# EAGLE design AVR Bus Controller (EAGLE 5.06)
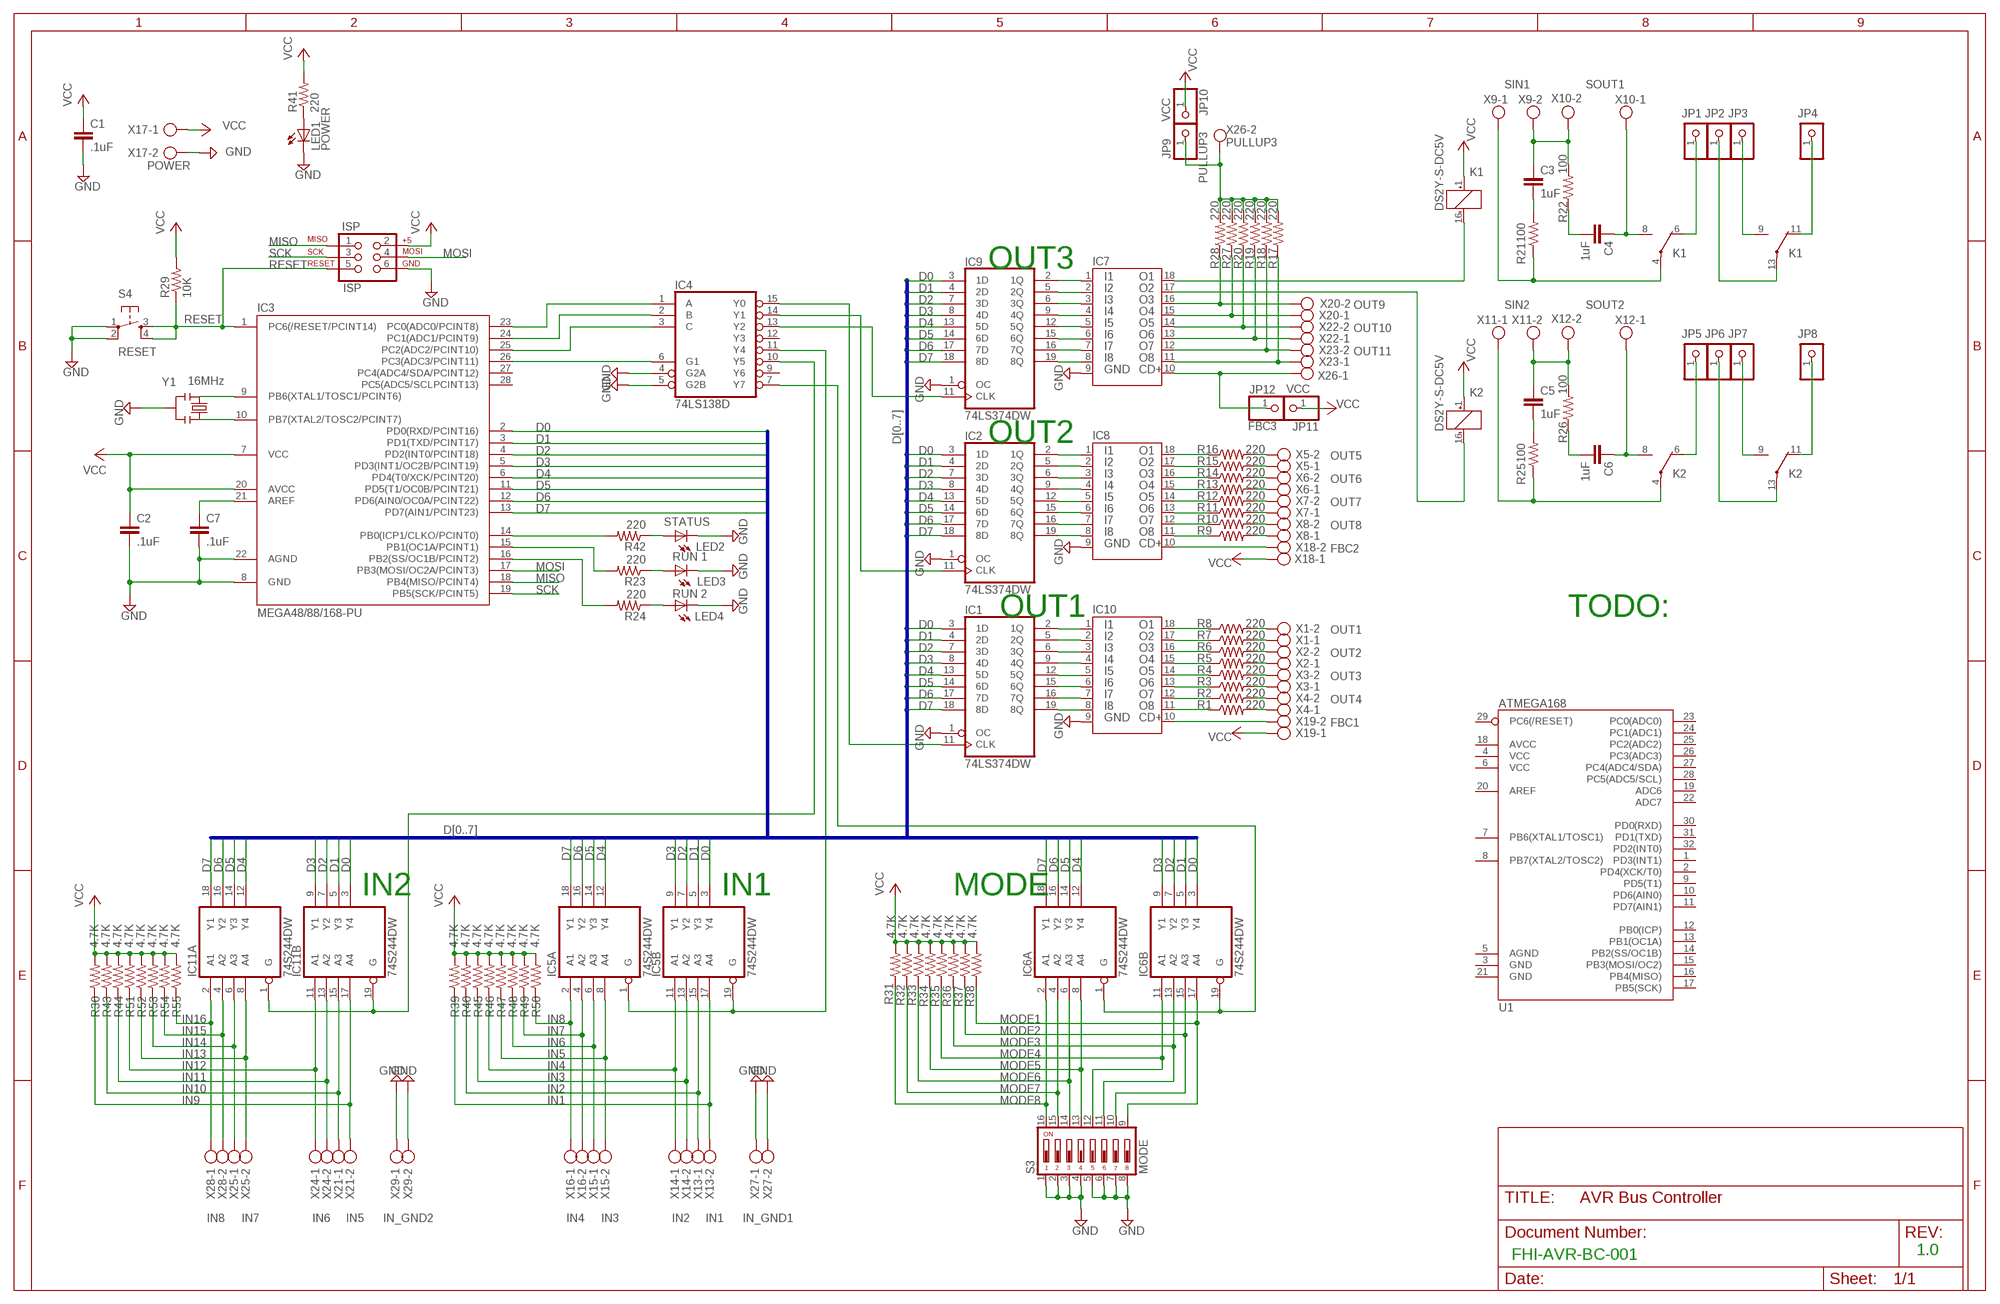
[diagram p0: schematic, sheet 1]

## Parts
C1  .1uF  C-EU025-025X050  [C025-025X050]
C2  .1uF  C-EU025-025X050  [C025-025X050]
C3  1uF  C-EU025-025X050  [C025-025X050]
C4  1uF  C-EU025-025X050  [C025-025X050]
C5  1uF  C-EU025-025X050  [C025-025X050]
C6  1uF  C-EU025-025X050  [C025-025X050]
C7  .1uF  C-EU025-025X050  [C025-025X050]
IC1  74LS374DW  [SO20W]
IC2  74LS374DW  [SO20W]
IC3  MEGA48/88/168-PU  [DIL28-3]
IC4  74LS138D  [SO16]
IC5  74S244DW  [SO20W]
IC6  74S244DW  [SO20W]
IC7  ULN2803SOICW  [SO18L]
IC8  ULN2803SOICW  [SO18L]
IC9  74LS374DW  [SO20W]
IC10  ULN2803SOICW  [SO18L]
IC11  74S244DW  [SO20W]
ISP  ISP  AVR_SPI_PRG_6PTH  [2X3]
JP1  R1_NC1  PINHD-1X1  [1X01]
JP2  R1_NC1  PINHD-1X1  [1X01]
JP3  R1_NC1  PINHD-1X1  [1X01]
JP4  R1_NC1  PINHD-1X1  [1X01]
JP5  R1_NC1  PINHD-1X1  [1X01]
JP6  R1_NC1  PINHD-1X1  [1X01]
JP7  R1_NC1  PINHD-1X1  [1X01]
JP8  R1_NC1  PINHD-1X1  [1X01]
JP9  PULLUP3  PINHD-1X1  [1X01]
JP10  VCC  PINHD-1X1  [1X01]
JP11  VCC  PINHD-1X1  [1X01]
JP12  FBC3  PINHD-1X1  [1X01]
K1  DS2Y-S-DC5V  [DS2Y]
K2  DS2Y-S-DC5V  [DS2Y]
LED1  POWER  LEDCHIPLED_1206  [CHIPLED_1206]
LED2  STATUS  LED5MM  [LED5MM]
LED3  RUN 1  LED5MM  [LED5MM]
LED4  RUN 2  LED5MM  [LED5MM]
R1  220  R-US_0207/2V  [0207/2V]
R2  220  R-US_0207/2V  [0207/2V]
R3  220  R-US_0207/2V  [0207/2V]
R4  220  R-US_0207/2V  [0207/2V]
R5  220  R-US_0207/2V  [0207/2V]
R6  220  R-US_0207/2V  [0207/2V]
R7  220  R-US_0207/2V  [0207/2V]
R8  220  R-US_0207/2V  [0207/2V]
R9  220  R-US_0207/2V  [0207/2V]
R10  220  R-US_0207/2V  [0207/2V]
R11  220  R-US_0207/2V  [0207/2V]
R12  220  R-US_0207/2V  [0207/2V]
R13  220  R-US_0207/2V  [0207/2V]
R14  220  R-US_0207/2V  [0207/2V]
R15  220  R-US_0207/2V  [0207/2V]
R16  220  R-US_0207/2V  [0207/2V]
R17  220  R-US_0207/2V  [0207/2V]
R18  220  R-US_0207/2V  [0207/2V]
R19  220  R-US_0207/2V  [0207/2V]
R20  220  R-US_0207/2V  [0207/2V]
R21  100  R-US_0207/2V  [0207/2V]
R22  100  R-US_0207/2V  [0207/2V]
R23  220  R-US_0207/2V  [0207/2V]
R24  220  R-US_0207/2V  [0207/2V]
R25  100  R-US_0207/2V  [0207/2V]
R26  100  R-US_0207/2V  [0207/2V]
R27  220  R-US_0207/2V  [0207/2V]
R28  220  R-US_0207/2V  [0207/2V]
R29  10K  R-US_0207/2V  [0207/2V]
R30  4.7K  R-US_0207/2V  [0207/2V]
R31  4.7K  R-US_0207/2V  [0207/2V]
R32  4.7K  R-US_0207/2V  [0207/2V]
R33  4.7K  R-US_0207/2V  [0207/2V]
R34  4.7K  R-US_0207/2V  [0207/2V]
R35  4.7K  R-US_0207/2V  [0207/2V]
R36  4.7K  R-US_0207/2V  [0207/2V]
R37  4.7K  R-US_0207/2V  [0207/2V]
R38  4.7K  R-US_0207/2V  [0207/2V]
R39  4.7K  R-US_0207/2V  [0207/2V]
R40  4.7K  R-US_0207/2V  [0207/2V]
R41  220  R-US_0207/2V  [0207/2V]
R42  220  R-US_0207/2V  [0207/2V]
R43  4.7K  R-US_0207/2V  [0207/2V]
R44  4.7K  R-US_0207/2V  [0207/2V]
R45  4.7K  R-US_0207/2V  [0207/2V]
R46  4.7K  R-US_0207/2V  [0207/2V]
R47  4.7K  R-US_0207/2V  [0207/2V]
R48  4.7K  R-US_0207/2V  [0207/2V]
R49  4.7K  R-US_0207/2V  [0207/2V]
R50  4.7K  R-US_0207/2V  [0207/2V]
R51  4.7K  R-US_0207/2V  [0207/2V]
R52  4.7K  R-US_0207/2V  [0207/2V]
R53  4.7K  R-US_0207/2V  [0207/2V]
R54  4.7K  R-US_0207/2V  [0207/2V]
R55  4.7K  R-US_0207/2V  [0207/2V]
S3  MODE  DS08  [DS-08]
S4  RESET  TAC_SWITCHPTH  [TACTILE-PTH]
U1  ATMEGA168  [TQFP32-08]
X1  OUT1  AK550/2  [AK550/2]
X2  OUT2  AK550/2  [AK550/2]
X3  OUT3  AK550/2  [AK550/2]
X4  OUT4  AK550/2  [AK550/2]
X5  OUT5  AK550/2  [AK550/2]
X6  OUT6  AK550/2  [AK550/2]
X7  OUT7  AK550/2  [AK550/2]
X8  OUT8  AK550/2  [AK550/2]
X9  SIN1  AK550/2  [AK550/2]
X10  SOUT1  AK550/2  [AK550/2]
X11  SIN2  AK550/2  [AK550/2]
X12  SOUT2  AK550/2  [AK550/2]
X13  IN1  AK550/2  [AK550/2]
X14  IN2  AK550/2  [AK550/2]
X15  IN3  AK550/2  [AK550/2]
X16  IN4  AK550/2  [AK550/2]
X17  POWER  AK500/2  [AK500/2]
X18  FBC2  AK550/2  [AK550/2]
X19  FBC1  AK550/2  [AK550/2]
X20  OUT9  AK550/2  [AK550/2]
X21  IN5  AK550/2  [AK550/2]
X22  OUT10  AK550/2  [AK550/2]
X23  OUT11  AK550/2  [AK550/2]
X24  IN6  AK550/2  [AK550/2]
X25  IN7  AK550/2  [AK550/2]
X26  PULLUP3  AK550/2  [AK550/2]
X27  IN_GND1  AK550/2  [AK550/2]
X28  IN8  AK550/2  [AK550/2]
X29  IN_GND2  AK550/2  [AK550/2]
Y1  16MHz  RESONATORPTH  [RESONATOR-PTH]

## Nets
A0: IC3.23(PC0(ADC0/PCINT8)) IC4.1(A)
A1: IC3.24(PC1(ADC1/PCINT9)) IC4.2(B)
A2: IC3.25(PC2(ADC2/PCINT10)) IC4.3(C)
D0: IC1.3(1D) IC2.3(1D) IC3.2(PD0(RXD/PCINT16)) IC5.3(B:Y4) IC6.3(B:Y4) IC9.3(1D) IC11.3(B:Y4)
D1: IC1.4(2D) IC2.4(2D) IC3.3(PD1(TXD/PCINT17)) IC5.5(B:Y3) IC6.5(B:Y3) IC9.4(2D) IC11.5(B:Y3)
D2: IC1.7(3D) IC2.7(3D) IC3.4(PD2(INT0/PCINT18)) IC5.7(B:Y2) IC6.7(B:Y2) IC9.7(3D) IC11.7(B:Y2)
D3: IC1.8(4D) IC2.8(4D) IC3.5(PD3(INT1/OC2B/PCINT19)) IC5.9(B:Y1) IC6.9(B:Y1) IC9.8(4D) IC11.9(B:Y1)
D4: IC1.13(5D) IC2.13(5D) IC3.6(PD4(T0/XCK/PCINT20)) IC5.12(A:Y4) IC6.12(A:Y4) IC9.13(5D) IC11.12(A:Y4)
D5: IC1.14(6D) IC2.14(6D) IC3.11(PD5(T1/OC0B/PCINT21)) IC5.14(A:Y3) IC6.14(A:Y3) IC9.14(6D) IC11.14(A:Y3)
D6: IC1.17(7D) IC2.17(7D) IC3.12(PD6(AIN0/OC0A/PCINT22)) IC5.16(A:Y2) IC6.16(A:Y2) IC9.17(7D) IC11.16(A:Y2)
D7: IC1.18(8D) IC2.18(8D) IC3.13(PD7(AIN1/PCINT23)) IC5.18(A:Y1) IC6.18(A:Y1) IC9.18(8D) IC11.18(A:Y1)
EN_A: IC3.26(PC3(ADC3/PCINT11)) IC4.6(G1)
EN_IN1: IC4.11(Y4) IC5.1(A:G) IC5.19(B:G)
EN_MODE: IC4.7(Y7) IC6.1(A:G) IC6.19(B:G)
EN_OUT1: IC1.11(CLK) IC4.15(Y0)
EN_OUT2: IC2.11(CLK) IC4.14(Y1)
EN_OUT3: IC4.13(Y2) IC9.11(CLK)
FBC1: IC10.10 X19.2
FBC2: IC8.10 X18.2
FBC3: IC7.10 JP12.1 X26.1
GND: C1.2 C2.2 C7.2 IC1.1(OC) IC2.1(OC) IC3.8(GND) IC3.22(AGND) IC4.4(G2A) IC4.5(G2B) IC7.9 IC8.9 IC9.1(OC) IC10.9 ISP.6 LED1.C LED2.K(C) LED3.K(C) LED4.K(C) S3.1 S3.2 S3.3 S3.4 S3.5 S3.6 S3.7 S3.8 S4.1 S4.2 X17.2 X27.1 X27.2 X29.1 X29.2 Y1.2
IN1: IC5.17(B:A4) R39.1 X13.2
IN2: IC5.15(B:A3) R40.1 X13.1
IN3: IC5.13(B:A2) R45.1 X14.2
IN4: IC5.11(B:A1) R46.1 X14.1
IN5: IC5.8(A:A4) R47.1 X15.2
IN6: IC5.6(A:A3) R48.1 X15.1
IN7: IC5.4(A:A2) R49.1 X16.2
IN8: IC5.2(A:A1) R50.1 X16.1
IN9: IC11.17(B:A4) R30.1 X21.2
IN10: IC11.15(B:A3) R43.1 X21.1
IN11: IC11.13(B:A2) R44.1 X24.2
IN12: IC11.11(B:A1) R51.1 X24.1
IN13: IC11.8(A:A4) R52.1 X25.2
IN14: IC11.6(A:A3) R53.1 X25.1
IN15: IC11.4(A:A2) R54.1 X28.2
IN16: IC11.2(A:A1) R55.1 X28.1
MISO: IC3.18(PB4(MISO/PCINT4)) ISP.1
MODE1: IC6.17(B:A4) R38.1 S3.9
MODE2: IC6.15(B:A3) R37.1 S3.10
MODE3: IC6.13(B:A2) R36.1 S3.11
MODE4: IC6.11(B:A1) R35.1 S3.12
MODE5: IC6.8(A:A4) R34.1 S3.13
MODE6: IC6.6(A:A3) R33.1 S3.14
MODE7: IC6.4(A:A2) R32.1 S3.15
MODE8: IC6.2(A:A1) R31.1 S3.16
MOSI: IC3.17(PB3(MOSI/OC2A/PCINT3)) ISP.4
N$1: C3.2 R21.2
N$3: IC4.10(Y5) IC11.1(A:G) IC11.19(B:G)
N$4: IC10.12 R2.1
N$7: IC7.8 IC9.19(8Q)
N$8: IC7.7 IC9.16(7Q)
N$9: IC7.6 IC9.15(6Q)
N$10: IC7.5 IC9.12(5Q)
N$11: IC7.4 IC9.9(4Q)
N$12: IC10.18 R8.1
N$13: IC10.17 R7.1
N$14: IC10.16 R6.1
N$15: IC10.15 R5.1
N$16: IC7.3 IC9.6(3Q)
N$17: IC8.12 R10.1
N$18: IC7.2 IC9.5(2Q)
N$19: IC7.1 IC9.2(1Q)
N$20: IC1.16(7Q) IC10.7
N$21: IC10.14 R4.1
N$22: IC1.19(8Q) IC10.8
N$23: IC1.2(1Q) IC10.1
N$24: IC1.5(2Q) IC10.2
N$25: IC1.6(3Q) IC10.3
N$26: IC1.9(4Q) IC10.4
N$27: IC1.12(5Q) IC10.5
N$28: IC1.15(6Q) IC10.6
N$29: IC2.19(8Q) IC8.8
N$30: IC10.13 R3.1
N$31: IC2.16(7Q) IC8.7
N$32: IC10.11 R1.1
N$33: IC2.15(6Q) IC8.6
N$34: C4.2 R22.1
N$35: IC3.9(PB6(XTAL1/TOSC1/PCINT6)) Y1.1
N$36: IC3.10(PB7(XTAL2/TOSC2/PCINT7)) Y1.3
N$37: LED4.A R24.1
N$38: LED3.A R23.1
N$39: C7.1 IC3.21(AREF)
N$44: C5.2 R25.2
N$45: C6.2 R26.1
N$55: IC2.2(1Q) IC8.1
N$56: IC2.5(2Q) IC8.2
N$57: IC2.6(3Q) IC8.3
N$58: IC2.9(4Q) IC8.4
N$59: IC2.12(5Q) IC8.5
N$61: IC8.18 R16.1
N$62: IC8.17 R15.1
N$63: IC8.16 R14.1
N$64: IC8.15 R13.1
N$65: IC8.14 R12.1
N$66: IC8.13 R11.1
N$68: IC8.11 R9.1
N$71: LED1.A R41.1
N$106: LED2.A R42.1
OUT1: R8.2 X1.2
OUT2: R7.2 X1.1
OUT3: R6.2 X2.2
OUT4: R5.2 X2.1
OUT5: R4.2 X3.2
OUT6: R3.2 X3.1
OUT7: R2.2 X4.2
OUT8: R1.2 X4.1
OUT9: R16.2 X5.2
OUT10: R15.2 X5.1
OUT11: R14.2 X6.2
OUT12: R13.2 X6.1
OUT13: R12.2 X7.2
OUT14: R11.2 X7.1
OUT15: R10.2 X8.2
OUT16: R9.2 X8.1
OUT17: IC7.18 K1.16(1:-)
OUT18: IC7.17 K2.16(1:-)
OUT19: IC7.16 R28.1 X20.2
OUT20: IC7.15 R27.1 X20.1
OUT21: IC7.14 R20.1 X22.2
OUT22: IC7.13 R19.1 X22.1
OUT23: IC7.12 R18.1 X23.2
OUT24: IC7.11 R17.1 X23.1
PULLUP3: JP9.1 R17.2 R18.2 R19.2 R20.2 R27.2 R28.2 X26.2
R1_C1: K1.4(2:P) R21.1 X9.1
R1_C2: JP2.1 K1.13(3:P)
R1_GND: C3.1 R22.2 X9.2 X10.2
R1_NC1: JP1.1 K1.6(2:O)
R1_NC2: JP4.1 K1.11(3:O)
R1_NO1: C4.1 K1.8(2:S) X10.1
R1_NO2: JP3.1 K1.9(3:S)
R2_C1: K2.4(2:P) R25.1 X11.1
R2_C2: JP6.1 K2.13(3:P)
R2_GND: C5.1 R26.2 X11.2 X12.2
R2_NC1: JP5.1 K2.6(2:O)
R2_NC2: JP8.1 K2.11(3:O)
R2_NO1: C6.1 K2.8(2:S) X12.1
R2_NO2: JP7.1 K2.9(3:S)
RESET: IC3.1(PC6(/RESET/PCINT14)) ISP.5 R29.1 S4.3 S4.4
RUN1: IC3.15(PB1(OC1A/PCINT1)) R23.2
RUN2: IC3.16(PB2(SS/OC1B/PCINT2)) R24.2
SCK: IC3.19(PB5(SCK/PCINT5)) ISP.3
STATUS: IC3.14(PB0(ICP1/CLKO/PCINT0)) R42.2
VCC: C1.1 C2.1 IC3.7(VCC) IC3.20(AVCC) ISP.2 JP10.1 JP11.1 K1.1(1:+) K2.1(1:+) R29.2 R30.2 R31.2 R32.2 R33.2 R34.2 R35.2 R36.2 R37.2 R38.2 R39.2 R40.2 R41.2 R43.2 R44.2 R45.2 R46.2 R47.2 R48.2 R49.2 R50.2 R51.2 R52.2 R53.2 R54.2 R55.2 X17.1 X18.1 X19.1
Unconnected: IC3.27(PC4(ADC4/SDA/PCINT12)) IC3.28(PC5(ADC5/SCLPCINT13)) IC4.9(Y6) IC4.12(Y3) U1.1(PD3(INT1)) U1.2(PD4(XCK/T0)) U1.3(GND) U1.4(VCC) U1.5(AGND) U1.6(VCC) U1.7(PB6(XTAL1/TOSC1)) U1.8(PB7(XTAL2/TOSC2)) U1.9(PD5(T1)) U1.10(PD6(AIN0)) U1.11(PD7(AIN1)) U1.12(PB0(ICP)) U1.13(PB1(OC1A)) U1.14(PB2(SS/OC1B)) U1.15(PB3(MOSI/OC2)) U1.16(PB4(MISO)) U1.17(PB5(SCK)) U1.18(AVCC) U1.19(ADC6) U1.20(AREF) U1.21(GND) U1.22(ADC7) U1.23(PC0(ADC0)) U1.24(PC1(ADC1)) U1.25(PC2(ADC2)) U1.26(PC3(ADC3)) U1.27(PC4(ADC4/SDA)) U1.28(PC5(ADC5/SCL)) U1.29(PC6(/RESET)) U1.30(PD0(RXD)) U1.31(PD1(TXD)) U1.32(PD2(INT0))

## Buses
D[0..7]

## Notes on the sheet
- OUT3
- OUT2
- OUT1 | TODO:
- IN2 | IN1 | MODE
- 1.0
- FHI-AVR-BC-001

## Power pins joined to a net without a drawn wire
GND: IC1.10(GND) IC2.10(GND) IC4.8(GND) IC5.10(P:GND) IC6.10(P:GND) IC9.10(GND) IC11.10(P:GND)
VCC: IC1.20(VCC) IC2.20(VCC) IC4.16(VCC) IC5.20(P:VCC) IC6.20(P:VCC) IC9.20(VCC) IC11.20(P:VCC)

## Library data of the parts
C1-C7 = rcl:C-EU: CAPACITOR, European symbol
IC1 IC2 IC9 = 74xx-us:74*374: Octal D type transparent LATCH, edge triggered
IC3 = avr-6:MEGA48/88/168-PU
IC4 = 74xx-eu:74*138: 3-line to 8-line DECODER/DEMULTIPLEXER
IC5 IC6 IC11 = 74xx-us:74*244: Octal BUFFER and LINE DRIVER, 3-state
IC7 IC8 IC10 = SparkFun:ULN2803: Darlington Driver ULN2803 Darlington array. 500mA max per channel, 8-channel package. Spark Fun Electronics SKU : COM-00312
ISP = SparkFun:AVR_SPI_PRG_6: AVR ISP 6 Pin This is the reduced ISP connector for AVR programming. Common on Arduino. This footprint will take up less PCB space and can be used with a 10-pin to 6-pin adapter such as SKU: BOB-08508
JP1-JP12 = pinhead:PINHD-1X1: PIN HEADER
K1 K2 = relay:DS2Y-S-DC*: MINIATURE RELAY NAiS Source: http://www.mew-europe.com/.. en_ds_61005_0023.pdf
LED1-LED4 = led:LED: LED OSRAM: - CHIPLED LG R971, LG N971, LY N971, LG Q971, LY Q971, LO R971, LY R971 LH N974, LH R974 LS Q976, LO Q976, LY Q976 LO Q996 - Hyper CHIPLED LW Q18S LB Q993, LB Q99A, LB R99A - SideLED LS A670, LO A670, LY A670, LG A670, LP A670 LB A673, LV A673, LT A673, LW A673 LH A674 LY A675 LS A676, LA A676, LO A676, LY A676, LW A676 LS A679, LY A679, LG A679 - Hyper Micro SIDELED® LS Y876, LA Y876, LO Y876, LY Y876 LT Y87S - SmartLED LW L88C, LW L88S LB L89C, LB L89S, LG L890 LS L89K, LO L89K, LY L89K LS L896, LA L896, LO L896, LY L896 - TOPLED LS T670, LO T670, LY T670, LG T670, LP T670 LSG T670, LSP T670, LSY T670, LOP T670, LYG T670 LG T671, LOG T671, LSG T671 LB T673, LV T673, LT T673, LW T673 LH T674 LS T676, LA T676, LO T676, LY T676, LB T676, LH T676, LSB T676, LW T676 LB T67C, LV T67C, LT T67C, LS T67K, LO T67K, LY T67K, LW E67C LS E67B, LA E67B, LO E67B, LY E67B, LB E67C, LV E67C, LT E67C LW T67C LS T679, LY T679, LG T679 LS T770, LO T770, LY T770, LG T770, LP T770 LB T773, LV T773, LT T773, LW T773 LH T774 LS E675, LA E675, LY E675, LS T675 LS T776, LA T776, LO T776, LY T776, LB T776 LHGB T686 LT T68C, LB T68C - Hyper Mini TOPLED® LB M676 - Mini TOPLED Santana® LG M470 LS M47K, LO M47K, LY M47K Source: http://www.osram.convergy.de - LUMILED® LXK2-PW12-R00, LXK2-PW12-S00, LXK2-PW14-U00, LXK2-PW14-V00 LXK2-PM12-R00, LXK2-PM12-S00, LXK2-PM14-U00 LXK2-PE12-Q00, LXK2-PE12-R00, LXK2-PE12-S00, LXK2-PE14-T00, LXK2-PE14-U00 LXK2-PB12-K00, LXK2-PB12-L00, LXK2-PB12-M00, LXK2-PB14-N00, LXK2-PB14-P00, LXK2-PB14-Q00 LXK2-PR12-L00, LXK2-PR12-M00, LXK2-PR14-Q00, LXK2-PR14-R00 LXK2-PD12-Q00, LXK2-PD12-R00, LXK2-PD12-S00 LXK2-PH12-R00, LXK2-PH12-S00 LXK2-PL12-P00, LXK2-PL12-Q00, LXK2-PL12-R00 Source: www.luxeon.com
R1-R55 = resistor:R-US_: RESISTOR, American symbol
S3 = switch-dil:DS08: DIL/CODE SWITCH
S4 = SparkFun:TAC_SWITCH: Momentary Switch Button commonly used for reset or general input. Spark Fun Electronics SKU : COM-00097
U1 = SparkFun:ATMEGA168
X1-X16 X18-X29 = con-ptr500+_v5:AK550/2: CONNECTOR
X17 = con-ptr500:AK500/2: CONNECTOR
Y1 = SparkFun:RESONATOR: Resonator Small SMD resonator. This is the itty bitty 10/20MHz resonators with built in caps. CSTCE10M0G55 and CSTCE20M0V53. Footprint has been reviewed closely but hasn't been tested yet.

## Board
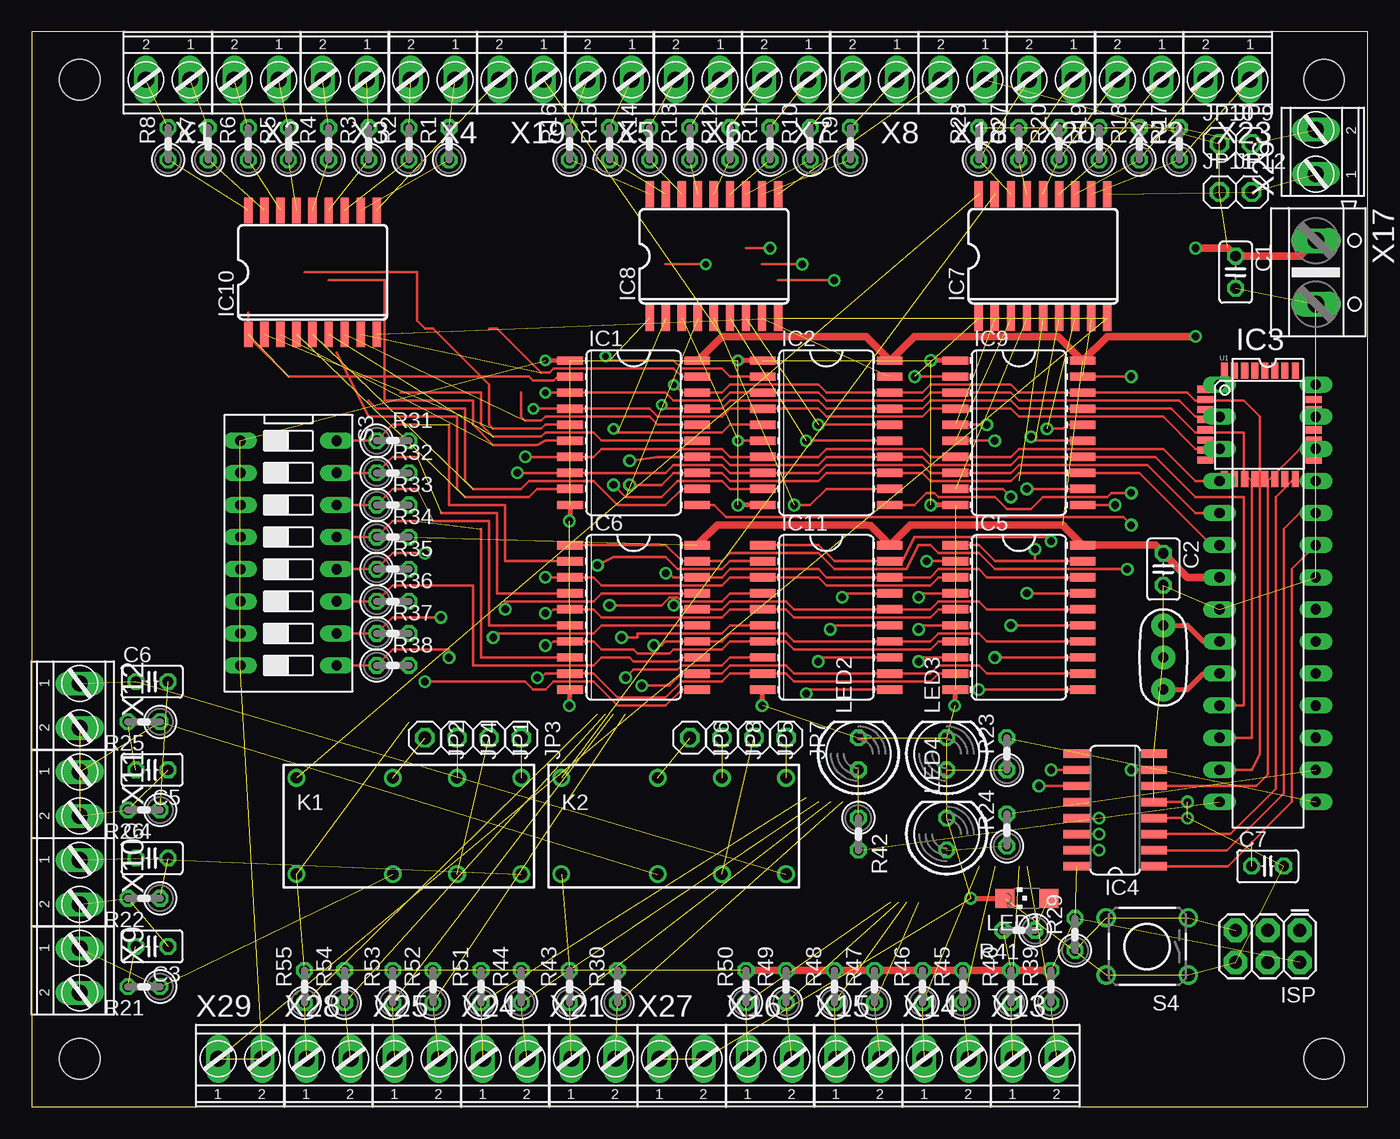
[diagram p1: board, top side]
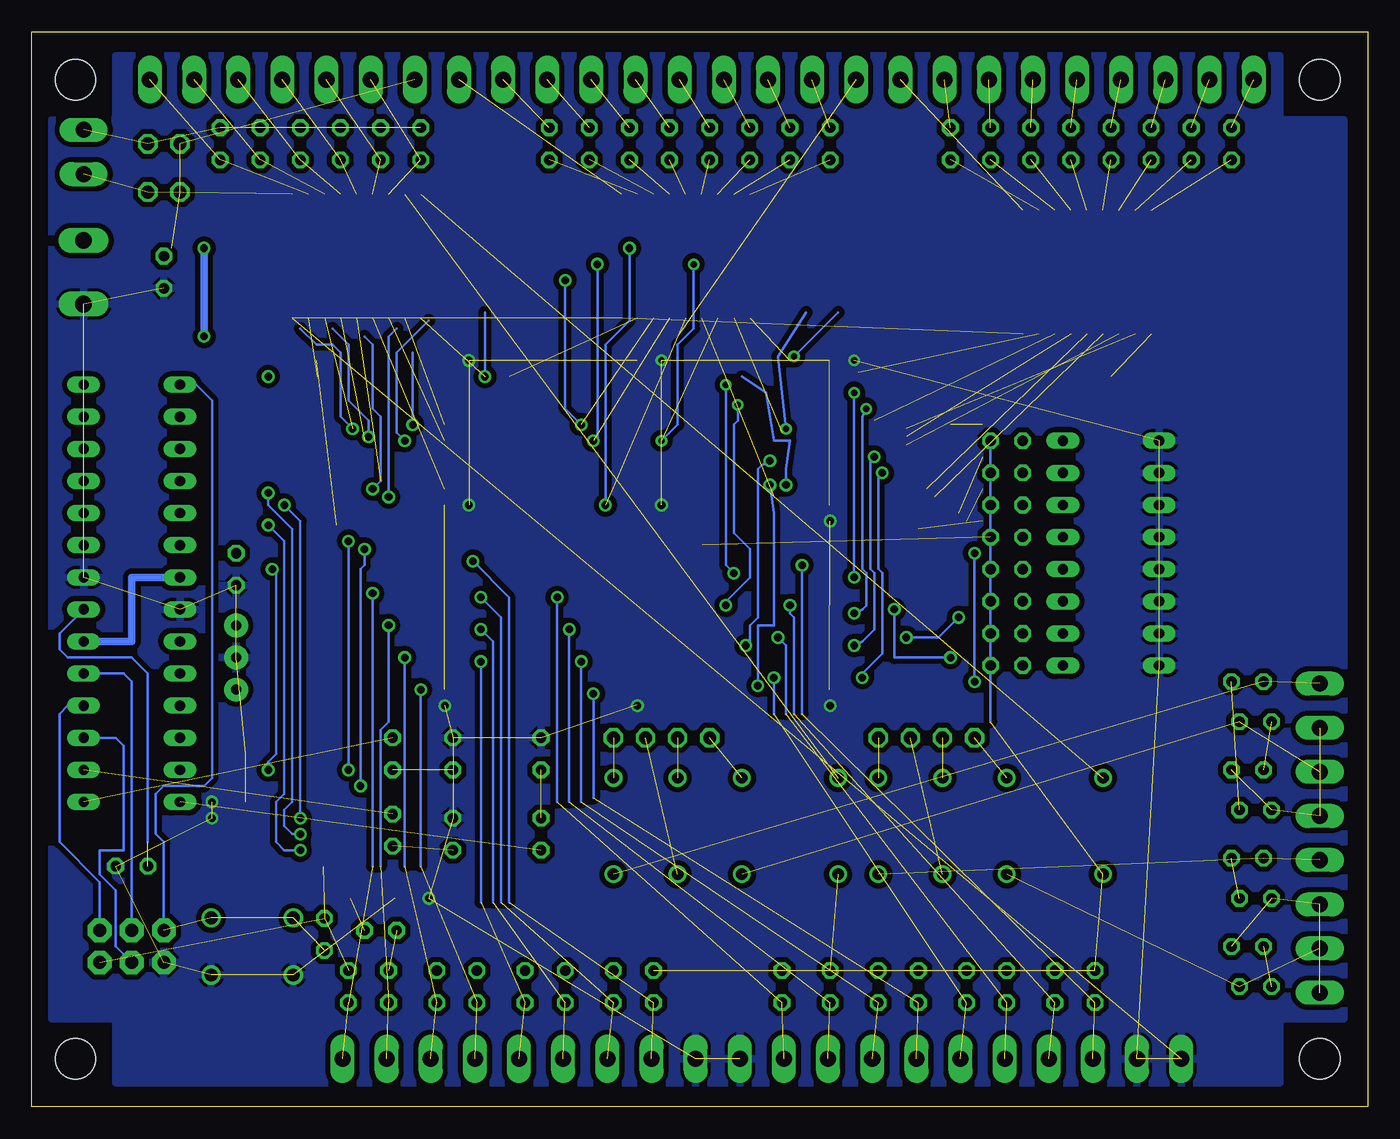
[diagram p2: board, bottom side, seen from below]

Size 105.72 x 85.08 mm. Coordinates in mm from the lower left corner, seen from the top.
Outline: 0,0 105.72,0 105.72,85.08 0,85.08 0,0
Copper layers (1*16): Top 0.035mm / dielectric 1.5mm / Bottom 0.035mm
Design rules "default *": minimum track width 8mil, minimum drill 20mil, track to track 8mil, track to pad 8mil, pad to pad 8mil, via to via 8mil, smd to smd 8mil, copper to edge 40mil, drill to drill 8mil, minimum pad ring 10mil, minimum via ring 8mil, stop-mask expansion 4mil, vias tented up to drill 0mil, thermal gap 10mil
Holes 3.2 mm at 102.23,81.28 102.23,3.81 3.81,3.81 3.81,81.28

### Footprints (pad centres in the part's own frame; a part is rotated, then mirrored left to right if it is on the bottom)
C025-025X050 = drill 0.813 octagon: 1 -1.27,0; 2 1.27,0
SO20W = smd 0.66 x 2.032: 1 -5.715,-5.029; 2 -4.445,-5.029; 3 -3.175,-5.029; 4 -1.905,-5.029; 5 -0.635,-5.029; 6 0.635,-5.029; 7 1.905,-5.029; 8 3.175,-5.029; 9 4.445,-5.029; 10 5.715,-5.029; 11 5.715,5.029; 12 4.445,5.029; 13 3.175,5.029; 14 1.905,5.029; 15 0.635,5.029; 16 -0.635,5.029; 17 -1.905,5.029; 18 -3.175,5.029; 19 -4.445,5.029; 20 -5.715,5.029
DIL28-3 = drill 0.813 long: 1 -16.51,-3.81; 2 -13.97,-3.81; 3 -11.43,-3.81; 4 -8.89,-3.81; 5 -6.35,-3.81; 6 -3.81,-3.81; 7 -1.27,-3.81; 8 1.27,-3.81; 9 3.81,-3.81; 10 6.35,-3.81; 11 8.89,-3.81; 12 11.43,-3.81; 13 13.97,-3.81; 14 16.51,-3.81; 15 16.51,3.81; 16 13.97,3.81; 17 11.43,3.81; 18 8.89,3.81; 19 6.35,3.81; 20 3.81,3.81; 21 1.27,3.81; 22 -1.27,3.81; 23 -3.81,3.81; 24 -6.35,3.81; 25 -8.89,3.81; 26 -11.43,3.81; 27 -13.97,3.81; 28 -16.51,3.81
SO16 = smd 0.66 x 2.032: 1 -4.445,-3.073; 2 -3.175,-3.073; 3 -1.905,-3.073; 4 -0.635,-3.073; 5 0.635,-3.073; 6 1.905,-3.073; 7 3.175,-3.073; 8 4.445,-3.073; 9 4.445,3.073; 10 3.175,3.073; 11 1.905,3.073; 12 0.635,3.073; 13 -0.635,3.073; 14 -1.905,3.073; 15 -3.175,3.073; 16 -4.445,3.073
SO18L = smd 0.66 x 2.032: 1 -0.635,-4.902; 2 0.635,-4.902; 3 1.905,-4.902; 4 3.175,-4.902; 5 4.445,-4.902; 6 5.715,-4.902; 7 6.985,-4.902; 8 8.255,-4.902; 9 9.525,-4.902; 10 9.525,4.902; 11 8.255,4.902; 12 6.985,4.902; 13 5.715,4.902; 14 4.445,4.902; 15 3.175,4.902; 16 1.905,4.902; 17 0.635,4.902; 18 -0.635,4.902
2X3 = drill 1.016 pad 1.88 octagon: 1 0,0; 2 0,2.54; 3 2.54,0; 4 2.54,2.54; 5 5.08,0; 6 5.08,2.54
1X01 = drill 1.016 octagon: 1 0,0
DS2Y = drill 0.9 round: 1 -8.89,-3.81; 4 -1.27,-3.81; 6 3.81,-3.81; 8 8.89,-3.81; 9 8.89,3.81; 11 3.81,3.81; 13 -1.27,3.81; 16 -8.89,3.81
CHIPLED_1206 = smd 1.5 x 1.5: A 0,-1.75; C 0,1.75
LED5MM = drill 0.813 octagon: A -1.27,0; K 1.27,0
0207/2V = drill 0.813 octagon: 1 -1.27,0; 2 1.27,0
DS-08 = drill 0.813 long: 1 -8.89,-3.81; 2 -6.35,-3.81; 3 -3.81,-3.81; 4 -1.27,-3.81; 5 1.27,-3.81; 6 3.81,-3.81; 7 6.35,-3.81; 8 8.89,-3.81; 9 8.89,3.81; 10 6.35,3.81; 11 3.81,3.81; 12 1.27,3.81; 13 -1.27,3.81; 14 -3.81,3.81; 15 -6.35,3.81; 16 -8.89,3.81
TACTILE-PTH = drill 1.016 round: 1 -3.251,2.261; 2 3.251,2.261; 3 -3.251,-2.261; 4 3.251,-2.261
TQFP32-08 = smd 1.27 x 0.559: 1 -4.293,2.8; 2 -4.293,2; 3 -4.293,1.2; 4 -4.293,0.4; 5 -4.293,-0.4; 6 -4.293,-1.2; 7 -4.293,-2; 8 -4.293,-2.8; 17 4.293,-2.8; 18 4.293,-2; 19 4.293,-1.2; 20 4.293,-0.4; 21 4.293,0.4; 22 4.293,1.2; 23 4.293,2; 24 4.293,2.8 | smd 0.559 x 1.27: 9 -2.8,-4.293; 10 -2,-4.293; 11 -1.2,-4.293; 12 -0.4,-4.293; 13 0.4,-4.293; 14 1.2,-4.293; 15 2,-4.293; 16 2.8,-4.293; 25 2.8,4.293; 26 2,4.293; 27 1.2,4.293; 28 0.4,4.293; 29 -0.4,4.293; 30 -1.2,4.293; 31 -2,4.293; 32 -2.8,4.293
AK550/2 = drill 1.27 long: 1 -1.75,0; 2 1.75,0
AK500/2 = drill 1.321 long: 1 -2.515,0; 2 2.515,0
RESONATOR-PTH = drill 0.8 pad 1.88 round: 1 -2.54,0; 2 0,0; 3 2.54,0

### Placement (x,y rotation side)
C1  95.25,66.04 270 top
C2  89.53,42.55 270 top
C3  9.53,12.7 180 top
C4  9.53,19.68 0 top
C5  9.53,26.67 180 top
C6  9.53,33.66 0 top
C7  97.79,19.05 0 top
IC1  47.62,53.34 270 top
IC2  62.87,53.34 270 top
IC3  97.79,40.64 270 top
IC4  85.72,23.5 90 top
IC5  78.11,38.73 270 top
IC6  47.62,38.73 270 top
IC7  75.56,67.31 0 top
IC8  49.53,67.31 0 top
IC9  78.11,53.34 270 top
IC10  17.78,66.04 0 top
IC11  62.87,38.73 270 top
ISP  100.33,13.97 180 top
JP1  36.2,29.21 270 top
JP2  31.11,29.21 270 top
JP3  38.73,29.21 270 top
JP4  33.66,29.21 270 top
JP5  57.15,29.21 270 top
JP6  52.07,29.21 270 top
JP7  59.69,29.21 270 top
JP8  54.61,29.21 270 top
JP9  96.52,76.2 0 top
JP10  93.98,76.2 0 top
JP11  93.98,72.39 0 top
JP12  96.52,72.39 0 top
K1  29.84,22.23 0 top
K2  50.8,22.23 0 top
LED1  78.74,16.51 90 top
LED2  65.41,27.94 90 top
LED3  72.39,27.94 90 top
LED4  72.39,21.59 90 top
R1  33.02,76.2 90 top
R2  29.84,76.2 90 top
R3  26.67,76.2 90 top
R4  23.5,76.2 90 top
R5  20.32,76.2 90 top
R6  17.14,76.2 90 top
R7  13.97,76.2 90 top
R8  10.79,76.2 90 top
R9  64.77,76.2 90 top
R10  61.59,76.2 90 top
R11  58.42,76.2 90 top
R12  55.24,76.2 90 top
R13  52.07,76.2 90 top
R14  48.9,76.2 90 top
R15  45.72,76.2 90 top
R16  42.55,76.2 90 top
R17  90.81,76.2 90 top
R18  87.63,76.2 90 top
R19  84.45,76.2 90 top
R20  81.28,76.2 90 top
R21  8.89,9.53 180 top
R22  8.89,16.51 180 top
R23  77.15,27.94 90 top
R24  77.15,21.91 90 top
R25  8.89,30.48 180 top
R26  8.89,23.5 180 top
R27  78.11,76.2 90 top
R28  74.93,76.2 90 top
R29  82.55,13.65 90 top
R30  46.35,9.53 90 top
R31  28.57,52.7 0 top
R32  28.57,50.16 0 top
R33  28.57,47.62 0 top
R34  28.57,45.09 0 top
R35  28.57,42.55 0 top
R36  28.57,40.01 0 top
R37  28.57,37.47 0 top
R38  28.57,34.92 0 top
R39  80.64,9.53 90 top
R40  77.47,9.53 90 top
R41  78.11,13.97 180 top
R42  65.41,21.59 270 top
R43  42.55,9.53 90 top
R44  38.73,9.53 90 top
R45  73.66,9.53 90 top
R46  70.48,9.53 90 top
R47  66.67,9.53 90 top
R48  63.5,9.53 90 top
R49  59.69,9.53 90 top
R50  56.52,9.53 90 top
R51  35.56,9.53 90 top
R52  31.75,9.53 90 top
R53  28.57,9.53 90 top
R54  24.77,9.53 90 top
R55  21.59,9.53 90 top
S3  20.32,43.81 270 top
S4  88.27,12.7 180 top
U1  97.16,53.98 0 top
X1  10.79,81.28 180 top
X2  17.78,81.28 180 top
X3  24.77,81.28 180 top
X4  31.75,81.28 180 top
X5  45.72,81.28 180 top
X6  52.7,81.28 180 top
X7  59.69,81.28 180 top
X8  66.67,81.28 180 top
X9  3.81,10.79 270 top
X10  3.81,17.78 270 top
X11  3.81,24.77 270 top
X12  3.81,31.75 270 top
X13  79.38,3.81 0 top
X14  72.39,3.81 0 top
X15  65.41,3.81 0 top
X16  58.42,3.81 0 top
X17  101.6,66.04 270 top
X18  73.66,81.28 180 top
X19  38.73,81.28 180 top
X20  80.64,81.28 180 top
X21  44.45,3.81 0 top
X22  87.63,81.28 180 top
X23  94.61,81.28 180 top
X24  37.47,3.81 0 top
X25  30.48,3.81 0 top
X26  101.6,75.56 90 top
X27  51.44,3.81 0 top
X28  23.5,3.81 0 top
X29  16.51,3.81 0 top
Y1  89.53,35.56 270 top

### Tracks (layer width: path | path; a pad name or v marks a point on that pad's centre or on a via)
A0
  Top 0.203: IC3.23 99.69,42.55 99.69,24.13 94.61,19.05 IC4.1
A1
  Top 0.203: IC3.24 100.33,46.99 99.06,45.72 99.06,24.81 94.57,20.32 IC4.2
A2
  Top 0.203: IC3.25 99.69,49.53 98.42,48.26 98.42,25.18 94.83,21.59 IC4.3
D0  (via drill 0.51, 0.6)
  Top 0.203: IC3.2 92.08,54.61 90.81,55.88 78.11,55.88 77.47,56.52 IC9.3 71.12,56.52 70.48,55.88 62.87,55.88 62.23,56.52 IC2.3 55.24,56.52 54.61,55.88 50.8,55.88 50.16,56.52 IC1.3 v40.64,56.52 | IC5.3 71.75,41.91 71.12,41.27 62.87,41.27 62.23,41.91 IC11.3 55.24,41.91 54.61,41.27 45.09,41.27 44.45,41.91 IC6.3 v40.64,41.91
  Bottom 0.203: v40.64,41.91 v40.64,56.52
D1  (via drill 0.51, 0.6)
  Top 0.203: IC3.3 92.08,52.07 89.53,54.61 78.11,54.61 77.47,55.24 IC9.4 71.12,55.24 70.48,54.61 62.87,54.61 62.23,55.24 IC2.4 55.24,55.24 54.61,54.61 49.53,54.61 48.9,55.24 IC1.4 v39.69,55.24 | IC5.5 71.75,39.37 71.12,38.73 60.33,38.73 59.69,39.37 IC11.5 55.24,39.37 54.61,38.73 45.09,38.73 44.45,39.37 IC6.5 41.27,39.37 40.96,39.05 v40.64,39.05
  Bottom 0.203: v40.64,39.05 40.01,39.37 39.69,39.69 39.69,42.23 40.01,42.55 40.01,54.61 v39.69,55.24
D2  (via drill 0.6)
  Top 0.203: IC3.4 92.08,49.53 89.53,52.07 78.11,52.07 77.47,51.44 IC9.7 71.12,51.44 70.48,52.07 62.87,52.07 62.23,51.44 IC2.7 55.24,51.44 54.61,52.07 45.09,52.07 44.45,51.44 IC1.7 v39.05,51.44 | IC5.7 71.75,36.83 71.12,36.2 60.33,36.2 59.69,36.83 IC11.7 55.24,36.83 54.61,36.2 50.8,36.2 50.48,35.88 47.94,35.88 47.62,36.2 45.09,36.2 44.45,36.83 IC6.7 41.27,36.83 40.96,36.51 v40.64,36.51
  Bottom 0.203: v40.64,36.51 40.01,36.83 39.05,37.78 39.05,42.23 39.37,42.55 39.37,51.12 v39.05,51.44
D3  (via drill 0.6)
  Top 0.203: IC3.5 92.08,46.99 88.27,50.8 78.11,50.8 77.47,50.16 IC9.8 71.12,50.16 70.48,50.8 62.87,50.8 62.23,50.16 IC2.8 55.24,50.16 54.61,50.8 50.8,50.8 50.16,50.16 IC1.8 v38.42,50.16 | IC5.9 71.75,34.29 71.12,33.66 60.33,33.66 59.69,34.29 IC11.9 55.24,34.29 54.61,33.66 51.44,33.66 50.16,32.38 46.35,32.38 44.45,34.29 IC6.9 40.64,34.29 40.32,33.97 v40.01,33.97
  Bottom 0.203: v40.01,33.97 40.01,34.29 38.42,35.88 38.42,42.23 38.73,42.55 38.73,49.85 v38.42,50.16
D4  (via drill 0.6)
  Top 0.203: IC3.6 93.34,44.45 87.63,50.16 IC9.13 78.11,50.16 77.47,49.53 71.12,49.53 70.48,50.16 IC2.13 62.87,50.16 62.23,49.53 55.24,49.53 54.61,50.16 IC1.13 50.8,50.16 49.85,49.21 v47.31,49.21 | IC5.12 75.56,34.29 74.93,34.92 71.75,34.92 71.12,34.29 IC11.12 60.33,34.29 59.69,34.92 55.24,34.92 54.61,34.29 IC6.12 51.44,34.29 50.48,33.34 v48.26,33.34
  Bottom 0.203: v48.26,33.34 48.26,38.1 46.99,38.1 46.99,46.99 v47.31,49.21
D5  (via drill 0.6)
  Top 0.203: IC3.11 95.89,31.75 95.89,48.26 92.08,48.26 88.9,51.44 IC9.14 78.11,51.44 77.47,50.8 71.12,50.8 70.48,51.44 IC2.14 | IC2.14 67.31,51.44 | IC2.14 62.87,51.44 62.23,50.8 55.24,50.8 54.61,51.44 IC1.14 49.53,51.44 v47.31,51.12 | IC5.14 75.56,36.83 74.93,37.47 71.75,37.47 71.12,36.83 IC11.14 60.33,36.83 59.69,37.47 55.24,37.47 54.61,36.83 IC6.14 50.16,36.83 49.85,36.51 v49.21,36.51
  Bottom 0.203: v49.21,36.51 48.9,36.83 48.9,38.1 48.26,38.73 48.26,50.48 47.94,50.8 v47.31,51.12
D6  (via drill 0.51, 0.6)
  Top 0.203: IC3.12 96.52,29.21 96.52,49.53 95.89,50.16 95.89,53.34 92.08,53.34 90.17,55.24 IC9.17 78.11,55.24 77.47,55.88 71.12,55.88 70.48,55.24 IC2.17 62.87,55.24 62.23,55.88 55.24,55.88 54.61,55.24 IC1.17 50.16,55.24 v49.85,55.56 | IC5.16 75.56,39.37 74.93,40.01 71.75,40.01 71.12,39.37 IC11.16 60.33,39.37 59.69,40.01 55.24,40.01 54.61,39.37 IC6.16 51.44,39.37 51.12,39.69 v50.8,39.69
  Bottom 0.203: v50.8,39.69 50.8,40.01 48.9,41.91 48.9,44.13 50.16,45.4 50.16,53.98 49.85,54.29 v49.85,55.56
D7  (via drill 0.51, 0.6)
  Top 0.203: IC3.13 96.52,26.67 97.16,27.94 97.16,54.61 95.89,55.88 92.08,55.88 91.44,56.52 IC9.18 78.11,56.52 77.47,57.15 71.12,57.15 70.48,56.52 IC2.18 62.87,56.52 62.23,57.15 55.24,57.15 54.61,56.52 IC1.18 51.44,56.52 v50.8,57.15 | IC5.18 75.56,41.91 74.93,42.55 71.75,42.55 71.12,41.91 IC11.18 62.87,41.91 62.23,42.55 55.24,42.55 54.61,41.91 IC6.18 50.8,41.91 50.48,42.23 v50.16,42.23
  Bottom 0.203: v50.16,42.23 50.8,42.86 v50.8,57.15
EN_A
  Top 0.203: IC3.26 100.33,52.07 97.79,49.53 97.79,26.3 96.89,25.4 IC4.6
EN_IN1  (via drill 0.6)
  Top 0.203: 79.38,43.18 76.2,43.18 74.93,44.45 IC5.1 | 79.38,43.18 IC5.19 | v79.38,44.13 79.38,43.18 | v79.69,25.4 IC4.11
  Bottom 0.203: v79.69,25.4 79.69,42.55 79.38,42.86 v79.38,44.13
EN_MODE  (via drill 0.6)
  Top 0.203: IC6.1 50.16,44.45 51.44,43.18 IC6.19 54.61,43.18 55.24,43.81 62.23,43.81 63.5,42.55 69.22,42.55 70.17,44.45 71.12,44.45 71.75,43.81 74.93,43.81 76.2,42.55 v86.68,42.55 | v87,26.67 IC4.7
  Bottom 0.203: v86.68,42.55 86.36,42.23 86.36,27.94 87,27.3 v87,26.67
EN_OUT1  (via drill 0.6)
  Top 0.203: IC1.11 53.98,47.62 54.93,46.67 86.36,46.67 v87,46.04 | v84.45,20.32 IC4.15
  Bottom 0.203: v87,46.04 85.72,44.77 85.72,24.77 86.36,24.13 86.36,20.95 85.72,20.32 v84.45,20.32
EN_OUT2  (via drill 0.6)
  Top 0.203: IC2.11 69.85,47.62 70.8,48.58 71.44,48.58 71.75,48.26 76.2,48.26 77.15,47.31 79.06,47.31 80.01,48.26 85.09,48.26 85.41,48.58 v87,48.58 | IC4.14 v84.45,21.59
  Bottom 0.203: v87,48.58 87,47.62 85.09,45.72 85.09,24.13 85.72,23.5 85.72,22.23 85.09,21.59 v84.45,21.59
EN_OUT3  (via drill 0.6)
  Top 0.203: v85.72,47.62 IC9.11 | IC4.13 v84.45,22.86
  Bottom 0.203: v85.72,47.62 84.45,46.35 v84.45,22.86
FBC1  (1 unrouted)
FBC2  (1 unrouted)
FBC3  (2 unrouted)
GND  (via drill 0.51, 0.6)  (40 unrouted)
  Top 0.203: IC4.5 v91.44,24.13 | IC4.4 v91.44,22.86
  Top 0.406: IC1.1 40.69,59 v40.64,59.05 | IC1.10 42.6,46.41 v42.55,46.35 | IC2.10 v55.88,47.62 | IC9.1 v71.12,59.05 | IC9.10 v71.12,47.62 | v42.55,31.75 IC6.10 | IC11.10 57.84,31.8 v57.78,31.75 | IC5.10 73.08,31.8 v73.03,31.75 | v74.3,16.51 LED1.C | IC2.1 v55.88,59.05
  pour Bottom (isolate 0.406): 1.91,78.11 6.99,78.11 6.99,83.19 99.06,83.19 99.06,78.11 104.14,78.11 104.14,6.99 99.06,6.99 99.06,1.91 6.99,1.91 6.99,6.99 1.91,6.99
IN1  (via drill 0.6)  (2 unrouted)
  Top 0.203: v78.74,40.64 IC5.17
  Bottom 0.203: v78.74,40.64 78.74,19.05
IN2  (via drill 0.6)  (2 unrouted)
  Top 0.203: v77.47,38.1 IC5.15
  Bottom 0.203: v77.47,38.1 77.47,30.48 78.11,29.84 78.11,19.05
IN3  (via drill 0.6)  (2 unrouted)
  Top 0.203: v76.2,35.56 IC5.13
  Bottom 0.203: v76.2,35.56 76.2,19.05
IN4  (via drill 0.6)  (2 unrouted)
  Top 0.203: v74.93,33.02 IC5.11
  Bottom 0.203: v74.93,33.02 74.93,19.05
IN5  (via drill 0.6)  (2 unrouted)
  Top 0.203: IC5.8 70.48,35.56 v70.17,35.24
  Bottom 0.203: v70.17,35.24 70.17,16.19
IN6  (via drill 0.6)  (2 unrouted)
  Top 0.203: IC5.6 70.48,38.1 v70.17,37.78
  Bottom 0.203: v70.17,37.78 69.22,36.83 69.22,16.19
IN7  (via drill 0.6)  (2 unrouted)
  Top 0.203: IC5.4 70.48,40.64 v70.17,40.32
  Bottom 0.203: v70.17,40.32 68.58,38.73 68.58,16.19
IN8  (via drill 0.6)  (2 unrouted)
  Top 0.203: v70.8,43.18 IC5.2
  Bottom 0.203: v70.8,43.18 67.94,40.32 67.94,16.19
IN9  (via drill 0.6)  (2 unrouted)
  Top 0.203: IC11.17 64.45,40.64 v64.14,40.32
  Bottom 0.203: 64.14,24.13 v64.14,40.32
IN10  (via drill 0.6)  (2 unrouted)
  Top 0.203: IC11.15 63.5,38.1 v63.18,37.78
  Bottom 0.203: v63.18,37.78 63.18,24.13
IN11  (via drill 0.6)  (2 unrouted)
  Top 0.203: IC11.13 62.55,35.56 v62.23,35.24
  Bottom 0.203: v62.23,35.24 62.23,24.13
IN12  (via drill 0.6)  (2 unrouted)
  Top 0.203: IC11.11 61.59,33.02 v61.28,32.7
  Bottom 0.203: v61.28,32.7 61.28,24.45
IN13  (via drill 0.6)  (2 unrouted)
  Top 0.203: IC11.8 55.24,35.56 54.61,34.92 51.44,34.92 51.12,34.61 47.62,34.61 v46.99,33.97
  Bottom 0.203: 46.99,31.11 v46.99,33.97
IN14  (via drill 0.6)  (2 unrouted)
  Top 0.203: IC11.6 55.24,38.1 54.61,37.47 47.94,37.47 47.94,37.15 v46.67,37.15
  Bottom 0.203: v46.67,37.15 46.04,36.51 46.04,31.11
IN15  (via drill 0.6)  (2 unrouted)
  Top 0.203: IC11.4 55.24,40.64 54.61,40.01 51.44,40.01 51.12,40.32 50.48,40.32 49.85,39.69 v45.72,39.69
  Bottom 0.203: 45.4,31.11 45.4,38.73 45.72,39.05 v45.72,39.69
IN16  (via drill 0.6)  (2 unrouted)
  Top 0.203: IC11.2 55.24,43.18 54.61,42.55 51.12,42.55 50.16,43.5 46.04,43.5 v44.77,42.86
  Bottom 0.203: 44.77,31.11 v44.77,42.86
MISO
  Bottom 0.203: IC3.18 102.87,31.75 103.5,31.11 103.5,20.95 100.33,17.78 ISP.1
MODE1  (via drill 0.6)
  Top 0.203: S3.9 R38.1 28.57,36.2 33.02,36.2 v33.02,35.56 | IC6.17 45.09,40.64 44.45,40.01 37.47,40.01 v37.47,39.37
  Bottom 0.203: v37.47,39.37 37.47,35.56 v33.02,35.56
MODE2  (via drill 0.6)
  Top 0.203: S3.10 R37.1 28.57,38.73 29.84,38.73 | 29.84,38.73 30.48,38.73 | IC6.15 45.09,38.1 44.45,37.47 36.83,37.47 v36.51,37.15 | 29.84,38.73 v32.38,38.73
  Bottom 0.203: v36.51,37.15 33.97,37.15 v32.38,38.73
MODE3
  Top 0.203: S3.11 R36.1 28.57,41.27 34.92,41.27 34.92,34.92 44.45,34.92 45.09,35.56 47.31,35.56 47.62,35.24 51.12,35.24 51.44,35.56 IC6.13
MODE4  (via drill 0.6)
  Top 0.203: S3.12 R35.1 28.57,43.81 29.84,43.81 | 29.84,43.81 30.48,43.81 | IC6.11 51.44,33.02 50.16,31.75 46.35,31.75 44.45,33.66 41.27,33.66 40.64,33.02 39.69,33.02 39.05,33.66 v31.11,33.66 | 29.84,43.81 v31.11,43.81
  Bottom 0.203: v31.11,43.81 v31.11,33.66
MODE5  (1 unrouted)
  Top 0.203: S3.13 R34.1 28.57,46.35 30.48,46.35 | IC6.8 35.56,35.56 35.56,45.72
MODE6  (1 unrouted)
  Top 0.203: S3.14 R33.1 28.57,48.9 30.48,48.9 | IC6.6 36.2,38.1 36.2,46.35 31.75,46.35
MODE7  (1 unrouted)
  Top 0.203: S3.15 R32.1 28.57,51.44 30.48,51.44 | IC6.4 36.83,40.64 36.83,46.99 32.38,46.99
MODE8  (1 unrouted)
  Top 0.203: S3.16 R31.1 28.57,53.98 30.48,53.98 | IC6.2 37.47,43.18 37.47,47.62 33.02,47.62 33.02,53.98
MOSI
  Bottom 0.203: IC3.17 99.06,29.21 98.42,28.57 98.42,20.32 100.33,20.32 100.33,18.41 99.06,17.14 99.06,12.7 ISP.4
N$1  (1 unrouted)
N$3  (via drill 0.6)
  Top 0.203: IC11.1 62.23,44.45 63.5,43.18 IC11.19 68.9,43.18 69.85,45.09 80.33,45.09 v80.64,44.77 | v80.64,26.67 IC4.10
  Bottom 0.203: v80.64,44.77 v80.64,26.67
N$4  (1 unrouted)
N$7  (via drill 0.6)  (1 unrouted)
  Top 0.203: IC9.19 v87,57.78
N$8  (via drill 0.6)  (1 unrouted)
  Top 0.203: v80.33,53.66 81.6,53.66 81.92,53.98 IC9.16
  Bottom 0.203: 84.45,61.59 83.19,60.33 81.92,60.33 81.28,59.69 81.28,54.61 v80.33,53.66
N$9  (via drill 0.6)  (1 unrouted)
  Top 0.203: IC9.15 79.38,52.7 v79.06,53.02
  Bottom 0.203: 81.92,61.59 80.64,60.33 80.64,55.88 79.06,54.29 v79.06,53.02
N$10  (via drill 0.6)  (1 unrouted)
  Top 0.203: v78.74,48.9 IC9.12
  Bottom 0.203: 79.38,60.96 78.74,60.33 78.74,55.24 78.11,54.61 78.11,49.53 v78.74,48.9
N$11  (via drill 0.6)  (1 unrouted)
  Top 0.203: IC9.9 76.83,48.9 v77.47,48.26
  Bottom 0.203: 76.83,61.59 77.47,60.96 v77.47,48.26
N$12  (1 unrouted)
N$13  (1 unrouted)
N$14  (1 unrouted)
N$15  (1 unrouted)
N$16  (via drill 0.6)  (1 unrouted)
  Top 0.203: IC9.6 v76.2,52.7
  Bottom 0.203: 74.3,62.23 76.83,59.69 76.83,53.34 v76.2,52.7
N$17  (1 unrouted)
N$18  (via drill 0.6)  (1 unrouted)
  Top 0.203: IC9.5 v75.56,53.98
  Bottom 0.203: v75.56,53.98 75.56,59.69
N$19  (via drill 0.6)  (1 unrouted)
  Top 0.203: v69.85,57.78 IC9.2
  Bottom 0.203: v69.85,57.78 69.85,62.87
N$20  (1 unrouted)
  Top 0.203: IC1.16 49.53,53.98 48.9,54.61 40.64,54.61 40.32,54.29 39.05,54.29 38.73,54.61 38.73,56.52
N$21  (1 unrouted)
N$22  (1 unrouted)
  Top 0.203: IC1.19 51.44,57.78 50.8,58.42 41.27,58.42 40.96,58.1 40.32,58.1 36.83,61.59 36.2,61.59
N$23  (1 unrouted)
  Top 0.203: IC1.2 41.59,57.78 41.27,57.47 39.69,57.47 39.37,57.78 20.32,57.78 17.14,60.96 17.14,62.87
N$24  (1 unrouted)
  Top 0.203: IC1.5 40.64,53.98 40.32,53.66 36.51,53.66 36.2,53.98 36.2,57.15 31.75,61.59 31.11,61.59 30.48,62.23 30.48,66.04 21.59,66.04
N$25  (1 unrouted)
  Top 0.203: IC1.6 40.64,52.7 40.01,52.39 36.51,52.39 34.92,53.98 34.92,55.88 27.94,55.88 27.94,65.41 23.5,65.41
N$26  (1 unrouted)
  Top 0.203: IC1.9 40.01,48.9 39.37,48.26 34.29,48.26 33.66,48.9 33.66,54.61 26.67,54.61 24.13,59.69
N$27  (1 unrouted)
  Top 0.203: IC1.12 51.44,48.9 50.16,47.62 46.35,47.62 44.45,49.53 39.37,49.53 38.73,48.9 34.92,48.9 34.29,49.53 34.29,55.24 27.3,55.24 26.67,55.88
N$28  (1 unrouted)
  Top 0.203: IC1.15 45.09,52.7 44.45,53.34 40.64,53.34 40.32,53.02 36.51,53.02 35.56,53.98 35.56,56.52 29.21,56.52
N$29  (1 unrouted)
N$30  (1 unrouted)
N$31  (via drill 0.6)  (1 unrouted)
  Top 0.203: v62.23,53.98 IC2.16 | v63.5,65.41 59.05,65.41
  Bottom 0.203: 62.55,54.29 v62.23,53.98 63.5,55.24 v63.5,65.41
N$32  (1 unrouted)
N$33  (via drill 0.6)  (1 unrouted)
  Top 0.203: v61.28,52.7 IC2.15 | v60.96,66.67 57.78,66.67
  Bottom 0.203: v60.96,66.67 60.96,53.02 v61.28,52.7
N$34  (1 unrouted)
N$35
  Top 0.406: IC3.9 92.71,36.83 91.44,38.1 Y1.1
N$36
  Top 0.406: IC3.10 92.71,34.29 91.44,33.02 Y1.3
N$37  (1 unrouted)
N$38  (1 unrouted)
N$39  (1 unrouted)
  Bottom 0.203: IC3.21 103.5,37.47 103.5,36.2 102.87,35.56 97.79,35.56 96.52,34.29 96.52,20.95
N$44  (1 unrouted)
N$45  (1 unrouted)
N$55  (via drill 0.51)  (1 unrouted)
  Top 0.203: IC2.2 55.24,57.78 54.61,58.42 51.44,58.42 50.8,59.05 45.72,59.05 v45.4,59.37
  Bottom 0.203: v45.4,59.37 41.91,62.87
N$56  (via drill 0.51)  (1 unrouted)
  Top 0.203: IC2.5 55.24,53.98 54.61,53.34 46.35,53.34 v46.04,53.66
  Bottom 0.203: v46.04,53.66 46.67,59.37 44.45,62.87
N$57  (via drill 0.51)  (1 unrouted)
  Top 0.203: IC2.6 v55.88,52.7 | v53.34,66.67 50.16,66.67
  Bottom 0.203: v55.88,52.7 54.61,53.98 54.61,60.33 53.34,61.59 v53.34,66.67
N$58  (via drill 0.6)  (1 unrouted)
  Top 0.203: IC2.9 55.24,48.9 54.61,49.53 51.12,49.53 49.85,48.26 46.99,48.26 v46.04,49.21
  Bottom 0.203: 49.53,57.78 47.62,56.52 46.99,52.7 45.72,52.7 46.04,50.48 v46.04,49.21
N$59  (via drill 0.6)  (1 unrouted)
  Top 0.203: IC2.12 62.87,48.9 61.59,47.62 v60.33,47.62 | v58.42,67.94 56.52,67.94
  Bottom 0.203: v58.42,67.94 58.42,62.23 60.33,60.33 v60.33,47.62
N$61  (1 unrouted)
N$62  (1 unrouted)
N$63  (1 unrouted)
N$64  (1 unrouted)
N$65  (1 unrouted)
N$66  (1 unrouted)
N$68  (1 unrouted)
N$71  (1 unrouted)
N$106  (1 unrouted)
OUT1  (1 unrouted)
OUT2  (1 unrouted)
OUT3  (1 unrouted)
OUT4  (1 unrouted)
OUT5  (1 unrouted)
OUT6  (1 unrouted)
OUT7  (1 unrouted)
OUT8  (1 unrouted)
OUT9  (1 unrouted)
OUT10  (1 unrouted)
OUT11  (1 unrouted)
OUT12  (1 unrouted)
OUT13  (1 unrouted)
OUT14  (1 unrouted)
OUT15  (1 unrouted)
OUT16  (1 unrouted)
OUT17  (1 unrouted)
OUT18  (1 unrouted)
OUT19  (2 unrouted)
OUT20  (2 unrouted)
OUT21  (2 unrouted)
OUT22  (2 unrouted)
OUT23  (2 unrouted)
OUT24  (2 unrouted)
PULLUP3  (7 unrouted)
R1_C1  (2 unrouted)
R1_C2  (1 unrouted)
R1_GND  (3 unrouted)
R1_NC1  (1 unrouted)
R1_NC2  (1 unrouted)
R1_NO1  (2 unrouted)
R1_NO2  (1 unrouted)
R2_C1  (2 unrouted)
R2_C2  (1 unrouted)
R2_GND  (3 unrouted)
R2_NC1  (1 unrouted)
R2_NC2  (1 unrouted)
R2_NO1  (2 unrouted)
R2_NO2  (1 unrouted)
RESET  (3 unrouted)
  Bottom 0.203: IC3.1 92.71,57.15 91.44,55.88 91.44,26.04 92.08,25.4 95.25,25.4 95.89,24.77 95.89,21.59 95.25,20.95 ISP.5
RUN1  (1 unrouted)
RUN2  (1 unrouted)
SCK
  Bottom 0.203: IC3.19 98.42,34.29 97.79,33.66 ISP.3
STATUS  (1 unrouted)
VCC  (via drill 0.6)  (21 unrouted)
  Top 0.203: IC2.20 67.94,59.05
  Top 0.61: 67.94,59.05 69.85,60.96 81.23,60.96 IC9.20 83.19,59.05 85.09,60.96 v92.08,60.96 | IC1.20 52.7,59.05 54.61,60.96 66.04,60.96 66.04,60.91 IC2.20 | X17.1 100.99,67.94 100.97,67.94 100.33,67.31 C1.1 94.61,67.94 v92.08,67.94 | IC6.20 54.24,46.04 66.04,46.04 66.36,45.99 IC11.20 67.94,44.45 69.53,46.04 81.6,46.04 81.92,45.67 IC5.20 88.9,44.45 C2.1 91.44,41.91 IC3.7 | R39.2 R40.2 R45.2 R46.2 R47.2 R48.2 R49.2 R50.2
  Bottom 0.203: R31.2 R32.2 R33.2 R34.2 R35.2 R36.2 R37.2 R38.2 29.84,30.48
  Bottom 0.61: v92.08,60.96 v92.08,67.94 | IC3.7 97.79,41.91 97.79,36.83 IC3.20